# EAGLE schematic transmitter (EAGLE 7.4.0)
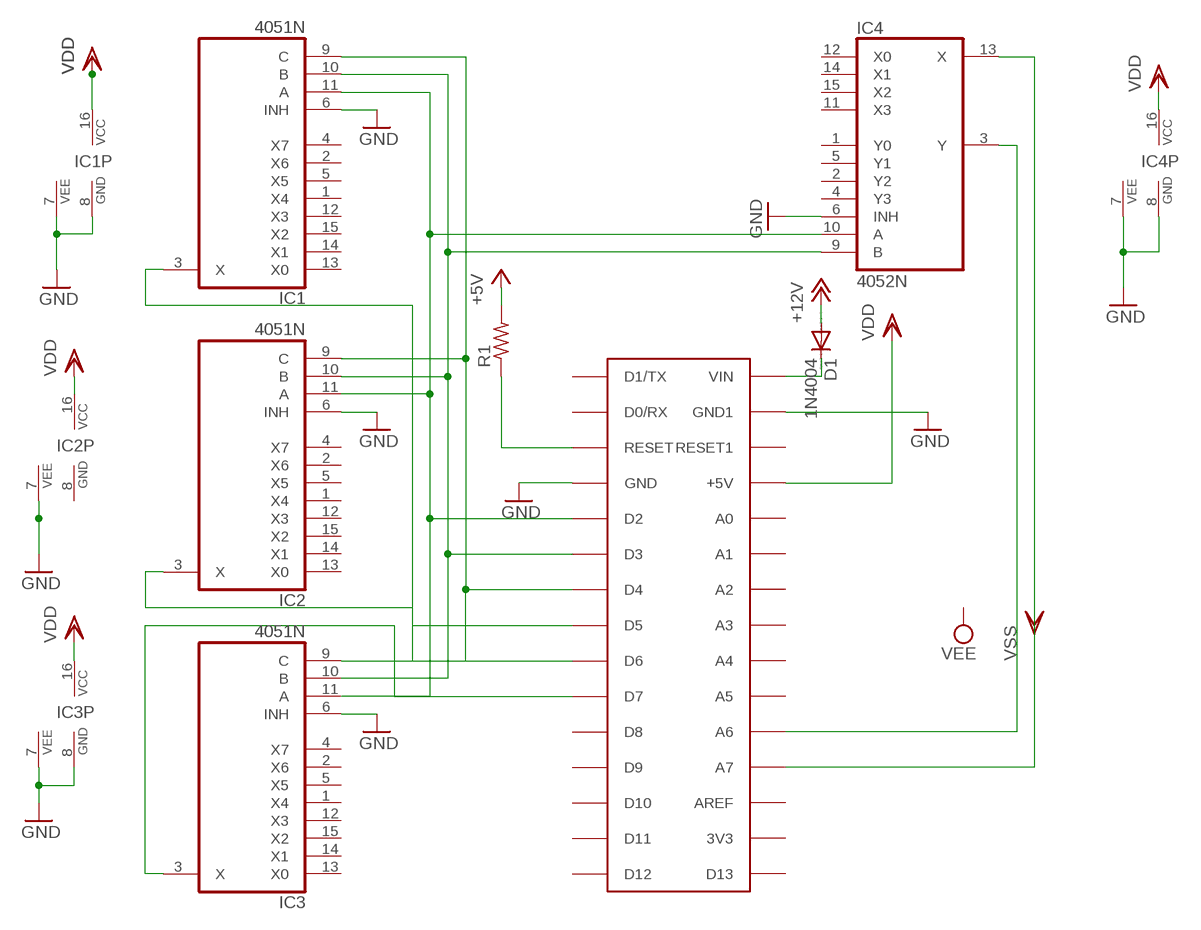
[diagram p0: schematic, sheet 1]

## Parts
D1  1N4004  [DO41-10]
IC1  4051N  [DIL16]
IC2  4051N  [DIL16]
IC3  4051N  [DIL16]
IC4  4052N  [DIL16]
R1  R-US_0613/15  [P0613/15]
U$1  ARDUINONANO  [PDIP-32]

## Nets
+5V: R1.2
+12V: D1.A
GND: IC1.6(INH) IC1.7(VEE) IC1.8(GND) IC2.6(INH) IC2.7(VEE) IC3.6(INH) IC3.7(VEE) IC3.8(GND) IC4.6(INH) IC4.7(VEE) IC4.8(GND) U$1.GND U$1.GND1
N$1: IC4.13(X) U$1.A7
N$2: IC4.3(Y) U$1.A6
N$3: IC1.11(A) IC2.11(A) IC3.11(A) IC4.10(A) U$1.D2
N$4: IC1.10(B) IC2.10(B) IC3.10(B) IC4.9(B) U$1.D3
N$5: IC1.9(C) IC2.9(C) IC3.9(C) U$1.D4
N$6: IC1.3(X) U$1.D5
N$7: IC2.3(X) U$1.D6
N$8: IC3.3(X) U$1.D7
N$9: D1.C U$1.VIN
N$10: R1.1 U$1.RESET
VDD: IC1.16(VCC) IC2.16(VCC) IC3.16(VCC) IC4.16(VCC) U$1.+5V
Unconnected: IC1.1(X4) IC1.2(X6) IC1.4(X7) IC1.5(X5) IC1.12(X3) IC1.13(X0) IC1.14(X1) IC1.15(X2) IC2.1(X4) IC2.2(X6) IC2.4(X7) IC2.5(X5) IC2.12(X3) IC2.13(X0) IC2.14(X1) IC2.15(X2) IC3.1(X4) IC3.2(X6) IC3.4(X7) IC3.5(X5) IC3.12(X3) IC3.13(X0) IC3.14(X1) IC3.15(X2) IC4.1(Y0) IC4.2(Y2) IC4.4(Y3) IC4.5(Y1) IC4.11(X3) IC4.12(X0) IC4.14(X1) IC4.15(X2) U$1.3V3 U$1.A0 U$1.A1 U$1.A2 U$1.A3 U$1.A4 U$1.A5 U$1.AREF U$1.D0/RX U$1.D1/TX U$1.D8 U$1.D9 U$1.D10 U$1.D11 U$1.D12 U$1.D13 U$1.RESET1

## Power pins joined to a net without a drawn wire
GND: IC2.8(GND)

## Library data of the parts
D1 = diode:1N4004: DIODE general purpose rectifier, 1 A
IC1-IC3 = 40xx:4051: 8-channel ANALOG MULTIPLEXER
IC4 = 40xx:4052: Dual 4-channel ANALOG MULTIPLEXER
R1 = resistor:R-US_: RESISTOR, American symbol
U$1 = jet-lib:ARDUINONANO

## Net classes
0 default: width 1.27 mm, drill 0.5 mm, clearance 0.75 mm